# Altium schematic sheet POWER_SCHEM_REV2.SchDoc
size A4; SheetNumber: 3; SheetTotal: 3
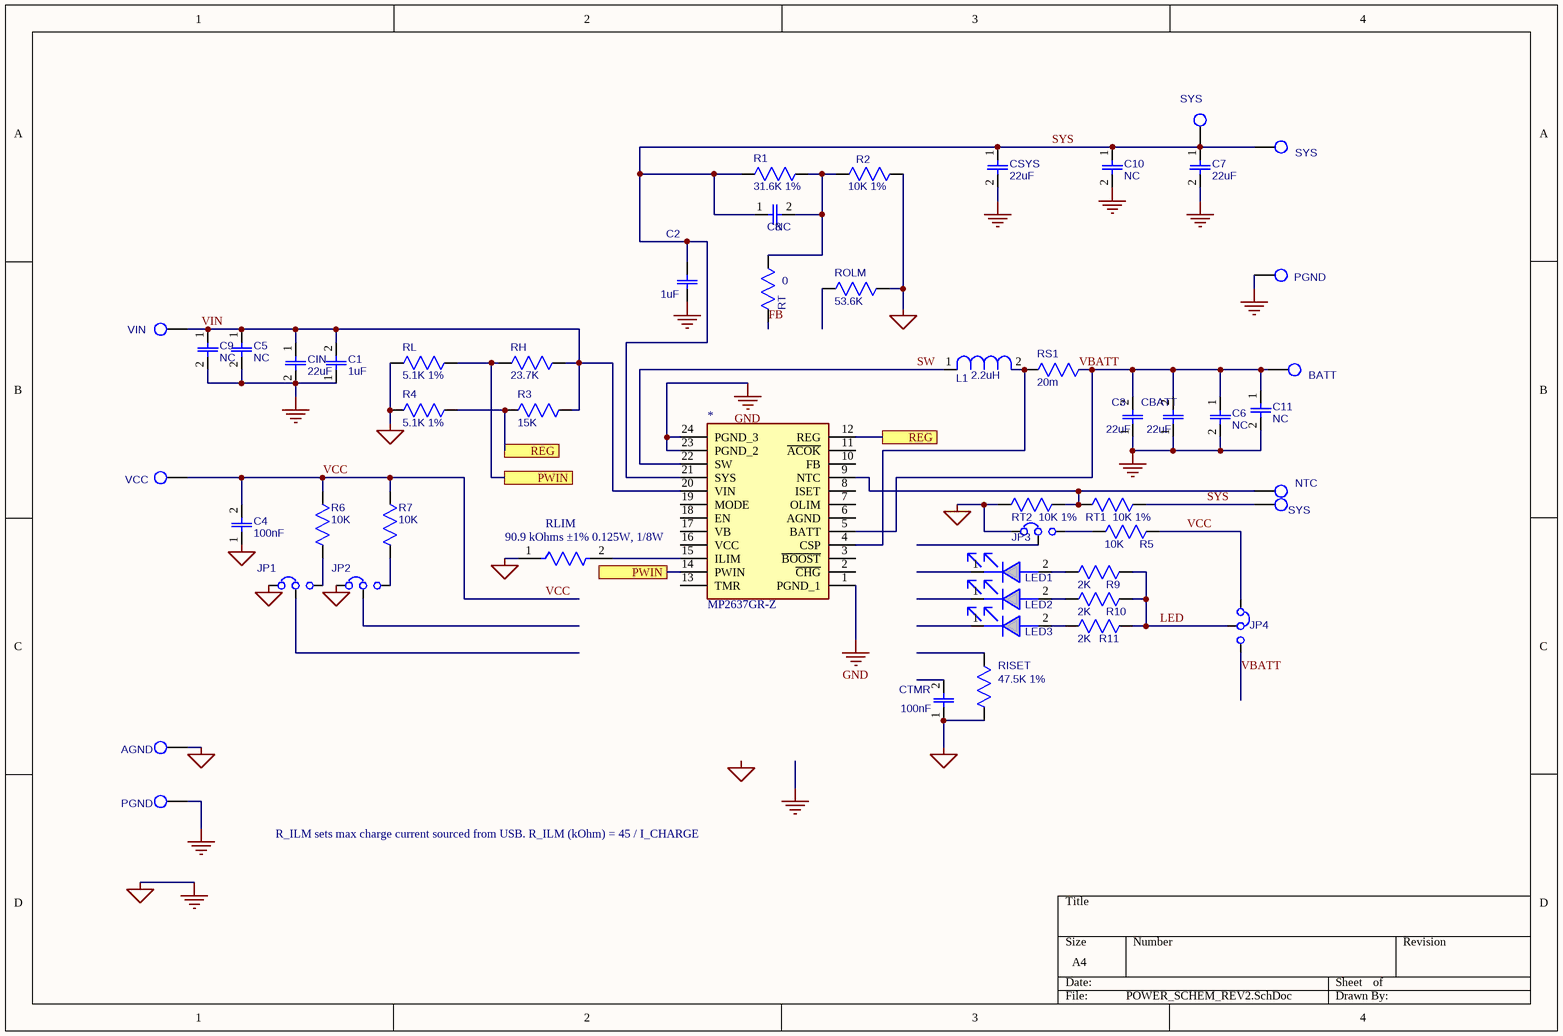
[diagram p0: POWER_SCHEM_REV2.SchDoc]

## Parts
*  MP2637GR-Z  [MP2637GRZ]
C1  value 1uF  [CAP/0603]  (hidden comment: CAP/0603)
C2  value 1uF  [CAP/0603]  (hidden comment: CAP/0603)
C3  value 22uF  [CAP/1206]  (hidden comment: CAP/1206)
C4  value 100nF  [CAP/0603]  (hidden comment: CAP/0603)
C5  value NC  [CAP/1206]  (hidden comment: CAP/1206)
C6  value NC  [CAP/1206]  (hidden comment: CAP/1206)
C7  value 22uF  [CAP/1206]  (hidden comment: CAP/1206)
C8  value NC  [CAP/0603]  (hidden comment: CAP/0603)
C9  value NC  [CAP/0603]  (hidden comment: CAP/0603)
C10  value NC  [CAP/0603]  (hidden comment: CAP/0603)
C11  value NC  [CAP/0603]  (hidden comment: CAP/0603)
CBATT  value 22uF  [CAP/1206]  (hidden comment: CAP/1206)
CIN  value 22uF  [CAP/1206]  (hidden comment: CAP/1206)
CSYS  value 22uF  [CAP/1206]  (hidden comment: CAP/1206)
CTMR  value 100nF  [CAP/0603]  (hidden comment: CAP/0603)
JP1  JUMPER/3PIN/DIP/2.54MM/B  [JUMPER/3P/DIP/2.54MM]  (value not drawn)
JP2  JUMPER/3PIN/DIP/2.54MM/B  [JUMPER/3P/DIP/2.54MM]  (value not drawn)
JP3  JUMPER/3PIN/DIP/2.54MM/B  [JUMPER/3P/DIP/2.54MM]  (value not drawn)
JP4  JUMPER/3PIN/DIP/2.54MM/B  [JUMPER/3P/DIP/2.54MM]  (value not drawn)
L1  value 2.2uH  [IND/Murata/LQH88PN]  (hidden comment: INDUCTOR)
LED1  LED/SMD/0805  [LED/SMD/0805]  (value not drawn)
LED2  LED/SMD/0805  [LED/SMD/0805]  (value not drawn)
LED3  LED/SMD/0805  [LED/SMD/0805]  (value not drawn)
R1  value 31.6K 1%  [RES/0603]  (hidden comment: RES/0603)
R2  value 10K 1%  [RES/0603]  (hidden comment: RES/0603)
R3  value 15K  [RES/0603]  (hidden comment: RES/0603)
R4  value 5.1K 1%  [RES/0603]  (hidden comment: RES/0603)
R5  value 10K  [RES/0603]  (hidden comment: RES/0603)
R6  value 10K  [RES/0603]  (hidden comment: RES/0603)
R7  value 10K  [RES/0603]  (hidden comment: RES/0603)
R9  value 2K  [RES/0603]  (hidden comment: RES/0603)
R10  value 2K  [RES/0603]  (hidden comment: RES/0603)
R11  value 2K  [RES/0603]  (hidden comment: RES/0603)
RH  value 23.7K  [RES/0603]  (hidden comment: RES/0603)
RISET  value 47.5K 1%  [RES/0603]  (hidden comment: RES/0603)
RL  value 5.1K 1%  [RES/0603]  (hidden comment: RES/0603)
RLIM  90.9 kOhms ±1% 0.125W, 1/8W  [FP-MCT0603-MFG]
ROLM  value 53.6K  [RES/0603]  (hidden comment: RES/0603)
RS1  value 20m  [RES/1206]  (hidden comment: RES/1206)
RT  value 0  [RES/0603]  (hidden comment: RES/0603)
RT1  value 10K 1%  [RES/0603]  (hidden comment: RES/0603)
RT2  value 10K 1%  [RES/0603]  (hidden comment: RES/0603)
TP1  VIN  [CONN/2MM]
TP2  PGND  [CONN/2MM]
TP3  VCC  [CONN/1MM]
TP5  AGND  [CONN/1MM]
TP6  SYS  [CONN/2MM]
TP8  SYS  [CONN/1MM]
TP9  BATT  [CONN/2MM]
TP10  NTC  [CONN/1MM]
TP11  PGND  [CONN/2MM]
TP12  SYS  [CONN/1MM]

## Ports
PWIN, REG

## Nets
GND: *.1(PGND_1) *.23(PGND_2) *.24(PGND_3) C1.1 C2.1 C3.1 C4.1 C5.2 C6.2 C7.2 C9.2 C10.2 C11.2 CBATT.1 CIN.2 CSYS.2 CTMR.1 JP1.1 JP2.1 JP3.1 R2.1 R4.1 RISET.1 RL.1 RLIM.1 ROLM.1 RT2.2 TP2.1 TP5.1 TP11.1  [also labelled PGND]
FB: RT.2
LED: JP4.2 R9.1 R10.1 R11.1
PWIN: *.14(PWIN) RH.1 RL.2 ; port PWIN
REG: *.12(REG) R3.1 R4.2 ; port REG
SW: *.22(SW) L1.1
SYS: *.21(SYS) C2.2 C7.1 C8.1 C10.1 CSYS.1 R1.2 RT1.1 TP6.1 TP8.1 TP12.1
VBATT: *.5(BATT) C3.2 C6.1 C11.1 CBATT.2 JP4.3 RS1.1 TP9.1
VCC: C4.2 JP4.1 R5.2 R6.2 R7.2 TP3.1
VIN: *.20(VIN) C1.2 C5.1 C9.1 CIN.1 R3.2 RH.2 TP1.1
Net*_4: *.4(CSP) L1.2 RS1.2
Net*_9: *.9(NTC) RT1.2 RT2.1 TP10.1
Net*_15: *.15(ILIM) RLIM.2
NetC8_2: C8.2 R1.1 R2.2 RT.1
NetJP1_3: JP1.3 R6.1
NetJP2_3: JP2.3 R7.1
NetJP3_3: JP3.3 R5.1
NetLED1_2: LED1.2 R9.2
NetLED2_2: LED2.2 R10.2
NetLED3_2: LED3.2 R11.2

Not connected (* = marked no-connect by the designer): * 2(~{CHG}) 3(~{BOOST}) 6(AGND) 7(OLIM) 8(ISET) 10(FB) 11(~{ACOK}) 13(TMR) 16(VCC) 17(VB) 18(EN) 19(MODE); CTMR 2; JP1 2; JP2 2; JP3 2; LED1 1; LED2 1; LED3 1; RISET 2; ROLM 2

## Notes on the sheet
- R_ILM sets max charge current sourced from USB. R_ILM (kOhm) = 45 / I_CHARGE
- Labels drawn without touching a wire or pin: GND

## Library data of the parts
* = MP2637GR-Z: Integrated Circuit; Manufacturer_Name: Monolithic Power Systems (MPS); Datasheet Link: http://www.monolithicpower.com/DesktopModules/DocumentManage/API/Document/getDocument?id=3326; Height: 1mm; Manufacturer_Part_Number: MP2637GR-Z; Mouser Part Number: 946-MP2637GR-Z; Mouser Price/Stock: https://www.mouser.co.uk/ProductDetail/Monolithic-Power-Systems-MPS/MP2637GR-Z?qs=493kPxzlxfKNmuqrCqIh9g%3D%3D
C1 = 07.0772: Ceramic Capacitor;25V;X7R; Manufacturer: {Manufacturer}; Manufacturer P/N: {Manufacturer P/N}; Part_Name: C1608X7R1E105K; Manufacture: TDK; Pid: 2193; Out_Num: 0; Note: 1uF/25V; Package: 0603; Part Number: 07.0772; Spec: Ceramic Capacitor; Manufacture_PN: C1608X7R1E105K; Stock_Num: 0; Available_Num: 0
C2 = 07.0043: Ceramic Capacitor;16V;X7R;0603;; Manufacturer: {Manufacturer}; Manufacturer P/N: {Manufacturer P/N}; Part_Name: GRM188R71C105KA12D; Manufacture: muRata; Pid: 680; Out_Num: 0; Available_Num: 2297; Package: 0603; Part Number: 07.0043; Spec: Ceramic Capacitor; Manufacture_PN: GRM188R71C105KA12D; Stock_Num: 2297
C3 CBATT = 07.0581: Ceramic Capacitor;10V;X7R;1206; Manufacturer: {Manufacturer}; Manufacturer P/N: {Manufacturer P/N}; Part_Name: GRM31CR71A226KE15L; Manufacture: muRata; Pid: 1170; Out_Num: 0; Available_Num: 1278; Package: 1206; Part Number: 07.0581; Spec: Ceramic Capacitor; Manufacture_PN: GRM31CR71A226KE15L; Stock_Num: 1278
C4 = 07.0053: Ceramic Capacitor;16V;X7R;0603;; Manufacturer: {Manufacturer}; Manufacturer P/N: {Manufacturer P/N}; Part_Name: GRM188R71C104KA01D; Manufacture: muRata; Pid: 1515; Out_Num: 1670; Available_Num: 848; Note: 100nF/16V; Package: 0603; Part Number: 07.0053; Spec: Ceramic Capacitor; Manufacture_PN: GRM188R71C104KA01D; Stock_Num: 2518
C5 CIN = 07.0752: Ceramic Capacitor;25V;X5R;; Manufacturer: {Manufacturer}; Manufacturer P/N: {Manufacturer P/N}; Part_Name: GRM31CR61E226KE15; Manufacture: Murata; Pid: 2173; Out_Num: 260; Available_Num: 1967; Note: 22uF/25V/1206; Package: 1206; Part Number: 07.0752; Spec: Ceramic Capacitor; Manufacture_PN: GRM31CR61E226KE15; Stock_Num: 2227
C6 C7 CSYS = 07.0581: Ceramic Capacitor;10V;X7R;1206; Manufacturer: {Manufacturer}; Manufacturer P/N: {Manufacturer P/N}; Part_Name: GRM31CR71A226KE15L; Manufacture: muRata; Pid: 2003; Out_Num: 0; Available_Num: 1278; Note: 22uF/10V/1206; Package: 1206; Part Number: 07.0581; Spec: Ceramic Capacitor; Manufacture_PN: GRM31CR71A226KE15L; Stock_Num: 1278
C8 = 07.0138: Ceramic Capacitor;50V;C0G;0603;; Manufacturer: {Manufacturer}; Manufacturer P/N: {Manufacturer P/N}; Part_Name: C1608C0G1H470J; Manufacture: TDK; Pid: 1600; Out_Num: 0; Available_Num: 5335; Note: 47pF/50V; Package: 0603; Part Number: 07.0138; Spec: Ceramic Capacitor; Manufacture_PN: C1608C0G1H470J; Stock_Num: 5335
C9 = 07.0772: Ceramic Capacitor;25V;X7R; Manufacturer: {Manufacturer}; Manufacturer P/N: {Manufacturer P/N}; Part_Name: C1608X7R1E105K; Manufacture: TDK; Pid: 2193; Out_Num: 310; Available_Num: 2930; Note: 1uF/25V; Package: 0603; Part Number: 07.0772; Spec: Ceramic Capacitor; Manufacture_PN: C1608X7R1E105K; Stock_Num: 3240
C10 C11 = 07.0043: Ceramic Capacitor;16V;X7R;0603;; Manufacturer: {Manufacturer}; Manufacturer P/N: {Manufacturer P/N}; Part_Name: GRM188R71C105KA12D; Manufacture: muRata; Pid: 1505; Out_Num: 0; Available_Num: 5801; Note: 1uF/16V; Package: 0603; Part Number: 07.0043; Spec: Ceramic Capacitor; Manufacture_PN: GRM188R71C105KA12D; Stock_Num: 5801
CTMR = 07.0051: Ceramic Capacitor;50V;X7R;0603;; Manufacturer: {Manufacturer}; Manufacturer P/N: {Manufacturer P/N}; Part_Name: GRM188R71H104KA93D; Manufacture: muRata; Pid: 688; Out_Num: 0; Available_Num: 3168; Package: 0603; Part Number: 07.0051; Spec: Ceramic Capacitor; Manufacture_PN: GRM188R71H104KA93D; Stock_Num: 3168
JP1-JP4 = JUMPER/3PIN/DIP/2.54MM/B: {Description}; Manufacturer P/N: {Manufacturer P/N}; Manufacturer: {Manufacturer}; Package: {Package}; Value: *
L1 = 03.0311: Inductor;2.2uH;9m;7.2A; Manufacturer: {Manufacturer}; Manufacturer P/N: {Manufacturer P/N}; Part_Name: LQH88PN2R2N38; Manufacture: MuRata; Pid: 1978; Out_Num: 0; Available_Num: 131; CName: Liny; ReferenceGuide: ÓÅÑ¡Æ÷¼þ; Note: 2.2uH/7.2A; Package: SMD; Part Number: 03.0311; Spec: Inductor; Manufacture_PN: LQH88PN2R2N38; Stock_Num: 131; Ctime: 2012/2/28 16:13:58; UPName: Liny; UPtime: 2012/2/28 16:13:58
LED1-LED3 = 19.0003: LED;ºì¹â;; Manufacturer P/N: {Manufacturer P/N}; Manufacturer: {Manufacturer}; Manufacture: BRIGHT LED; Value: BL-HUF35A-TRB; Pid: 37; Out_Num: 0; Available_Num: 1960; Package: 0805; Part Number: 19.0003; Spec: LED; Part_Name: BL-HUF35A-TRB; Manufacture_PN: BL-HUF35A-TRB; Stock_Num: 1960
R1 = 06.0160: Film Resistor;1%;; Manufacturer: Yageo; Manufacturer P/N: 9C06031A1203FKHFT; Part_Name: RC0603FR-0731K6L; Pid: 2840; Out_Num: 0; Available_Num: 4254; Note: 31.6k/1%; Distributor: Digikey; Package: 0603; Distributor P/N: 311-120KHCT-ND; Part Number: 06.0160; Spec: Film Resistor; Manufacture: Yageo; Manufacture_PN: RC0603FR-0731K6L; Stock_Num: 4254
R2 = 06.0112: Film Resistor;1%;; Manufacturer: Yageo; Manufacturer P/N: 9C06031A1203FKHFT; Part_Name: RC0603FR-0710KL; Pid: 2792; Out_Num: 2310; Available_Num: 7415; Note: 10k/1%; Distributor: Digikey; Package: 0603; Distributor P/N: 311-120KHCT-ND; Part Number: 06.0112; Spec: Film Resistor; Manufacture: Yageo; Manufacture_PN: RC0603FR-0710KL; Stock_Num: 9725
R3 = 06.0129: Film Resistor;1%;; Manufacturer: Yageo; Manufacturer P/N: 9C06031A1203FKHFT; Part_Name: RC0603FR-0715KL; Pid: 2809; Out_Num: 160; Available_Num: 3939; Note: 15k/1%; Distributor: Digikey; Package: 0603; Distributor P/N: 311-120KHCT-ND; Part Number: 06.0129; Spec: Film Resistor; Manufacture: Yageo; Manufacture_PN: RC0603FR-0715KL; Stock_Num: 4099
R4 RL = 06.0691: Film Resistor;1%;; Manufacturer: Yageo; Manufacturer P/N: 9C06031A1203FKHFT; Part_Name: RC0603FR-075K1L; Pid: 3353; Out_Num: 0; Available_Num: 5749; Note: 5.1k/1%; Distributor: Digikey; Package: 0603; Distributor P/N: 311-120KHCT-ND; Part Number: 06.0691; Spec: Film Resistor; Manufacture: Yageo; Manufacture_PN: RC0603FR-075K1L; Stock_Num: 5749
R5-R7 = 06.0284: Film Resistor;5%;; Manufacturer: Yageo; Manufacturer P/N: 9C06031A1203FKHFT; Part_Name: RC0603JR-0710K; Pid: 2947; Out_Num: 0; Available_Num: 6218; Distributor: Digikey; Package: 0603; Distributor P/N: 311-120KHCT-ND; Part Number: 06.0284; Spec: Film Resistor; Manufacture: Yageo; Manufacture_PN: RC0603JR-0710K; Stock_Num: 6218; Note: 10k
R9-R11 = 06.0015: Film Resistor;5%;1/10W; Manufacturer: Yageo; Manufacturer P/N: 9C06031A1203FKHFT; Part_Name: CR0603JA0202G; Manufacture: LIZ; Pid: 2695; Out_Num: 0; Available_Num: 3523; Distributor: Digikey; Package: 0603; Distributor P/N: 311-120KHCT-ND; Part Number: 06.0015; Spec: Film Resistor; Manufacture_PN: CR0603JA0202G; Stock_Num: 3523; Note: 2K
RH = 06.0148: Film Resistor;1%; Manufacturer: Yageo; Manufacturer P/N: 9C06031A1203FKHFT; Part_Name: RC0603FR-0723K7L; Pid: 2828; Out_Num: 0; Available_Num: 7686; Note: 23.7k/1%; Distributor: Digikey; Package: 0603; Distributor P/N: 311-120KHCT-ND; Part Number: 06.0148; Spec: Film Resistor; Manufacture: Yageo; Manufacture_PN: RC0603FR-0723K7L; Stock_Num: 7686
RISET = 06.0177: Film Resistor;1%; Manufacturer: Yageo; Manufacturer P/N: 9C06031A1203FKHFT; Part_Name: RC0603FR-0747K5L; Pid: 2857; Out_Num: 0; Available_Num: 7700; Note: 47.5k/1%; Distributor: Digikey; Package: 0603; Distributor P/N: 311-120KHCT-ND; Part Number: 06.0177; Spec: Film Resistor; Manufacture: Yageo; Manufacture_PN: RC0603FR-0747K5L; Stock_Num: 7700
RLIM = CMP-02407-000518-1: RES SMD 90.9kOhm 1% 1/8W 0603 90.9 kOhms ±1% 0.125W, 1/8W Chip Resistor 0603 (1608 Metric) Anti-Sulfur Thin Film; Voltage Rating (DC): 75V; Resistance: 90.9kR; Temperature Coefficient: 50ppm/°C; Power Rating: 100mW; Max Power Dissipation: 125mW; Case/Package: 0603; Radiation Hardening: No; Depth: 0.85mm; Min Operating Temperature: -55°C; Composition: Thin Film; Number of Terminations: 2; Length: 0.061inch; Max Operating Temperature: 125°C; Height: 0.022inch; Case Code (Imperial): 0603; Width: 0.033inch; Tolerance: 1%; Package Quantity: 5000; Voltage Rating: 75V; Military Standard: Not; Packaging: Tape and Reel; Contact Plating: Tin; Mount: Surface Mount; Case Code (Metric): 1608; Lead Free: Lead Free
ROLM = 06.0182: Film Resistor;1%; Manufacturer: Yageo; Manufacturer P/N: 9C06031A1203FKHFT; Part_Name: RC0603FR-0753K6L; Pid: 2862; Out_Num: 0; Available_Num: 9040; Note: 53.6k/1%; Distributor: Digikey; Package: 0603; Distributor P/N: 311-120KHCT-ND; Part Number: 06.0182; Spec: Film Resistor; Manufacture: Yageo; Manufacture_PN: RC0603FR-0753K6L; Stock_Num: 9040
RS1 = 06.0564: Film Resistor;1%; Manufacturer: Yageo; Manufacturer P/N: 9C06031A1203FKHFT; Part_Name: WSL1206-18; Manufacture: Vishay; Pid: 3227; Out_Num: 0; Available_Num: 291; Note: 20m/1%/1206; Distributor: Digikey; Package: 1206; Distributor P/N: 311-120KHCT-ND; Part Number: 06.0564; Spec: Film Resistor; Manufacture_PN: WSL1206-18; Stock_Num: 291
RT = 06.0039: Film Resistor;5%;; Manufacturer: Yageo; Manufacturer P/N: 9C06031A1203FKHFT; Part_Name: RC0603JR-070RL; Pid: 2719; Out_Num: 4670; Available_Num: 14667; Distributor: Digikey; Package: 0603; Distributor P/N: 311-120KHCT-ND; Part Number: 06.0039; Spec: Film Resistor; Manufacture: Yageo; Manufacture_PN: RC0603JR-070RL; Stock_Num: 19337; Note: 0
RT1 RT2 = 06.0112: Film Resistor;1%;; Manufacturer: Yageo; Manufacturer P/N: 9C06031A1203FKHFT; Part_Name: RC0603FR-0710KL; Pid: 2792; Out_Num: 2110; Available_Num: 16838; Note: 10k/1%; Distributor: Digikey; Package: 0603; Distributor P/N: 311-120KHCT-ND; Part Number: 06.0112; Spec: Film Resistor; Manufacture: Yageo; Manufacture_PN: RC0603FR-0710KL; Stock_Num: 18948
TP1-TP3 TP5 TP6 TP8-TP12 = 17.0025: Connector;; Manufacturer P/N: {Manufacturer P/N}; Manufacturer: {Manufacturer}; Part_Name: 2.0¹«Õë; Pid: 25; Out_Num: 1000; Available_Num: 34550; CName: Jiao Zhang; ReferenceGuide: ÆÕÍ¨Æ÷¼þ; Package: {Package}; Value: *; Part Number: 17.0025; Spec: Connector; Stock_Num: 35550; Ctime: 2010/5/24 14:17:26; UPName: Jiao Zhang; UPtime: 2010/8/18 16:36:42